# Altium schematic sheet Alim_Schematic.SchDoc: Alimentation et Regulation
size A4; Date: 13/04/2026; DrawnBy: JACOLOT Marine & GUILLEMOT Killian; Revision: Rev A; SheetNumber: 1; SheetTotal: 4
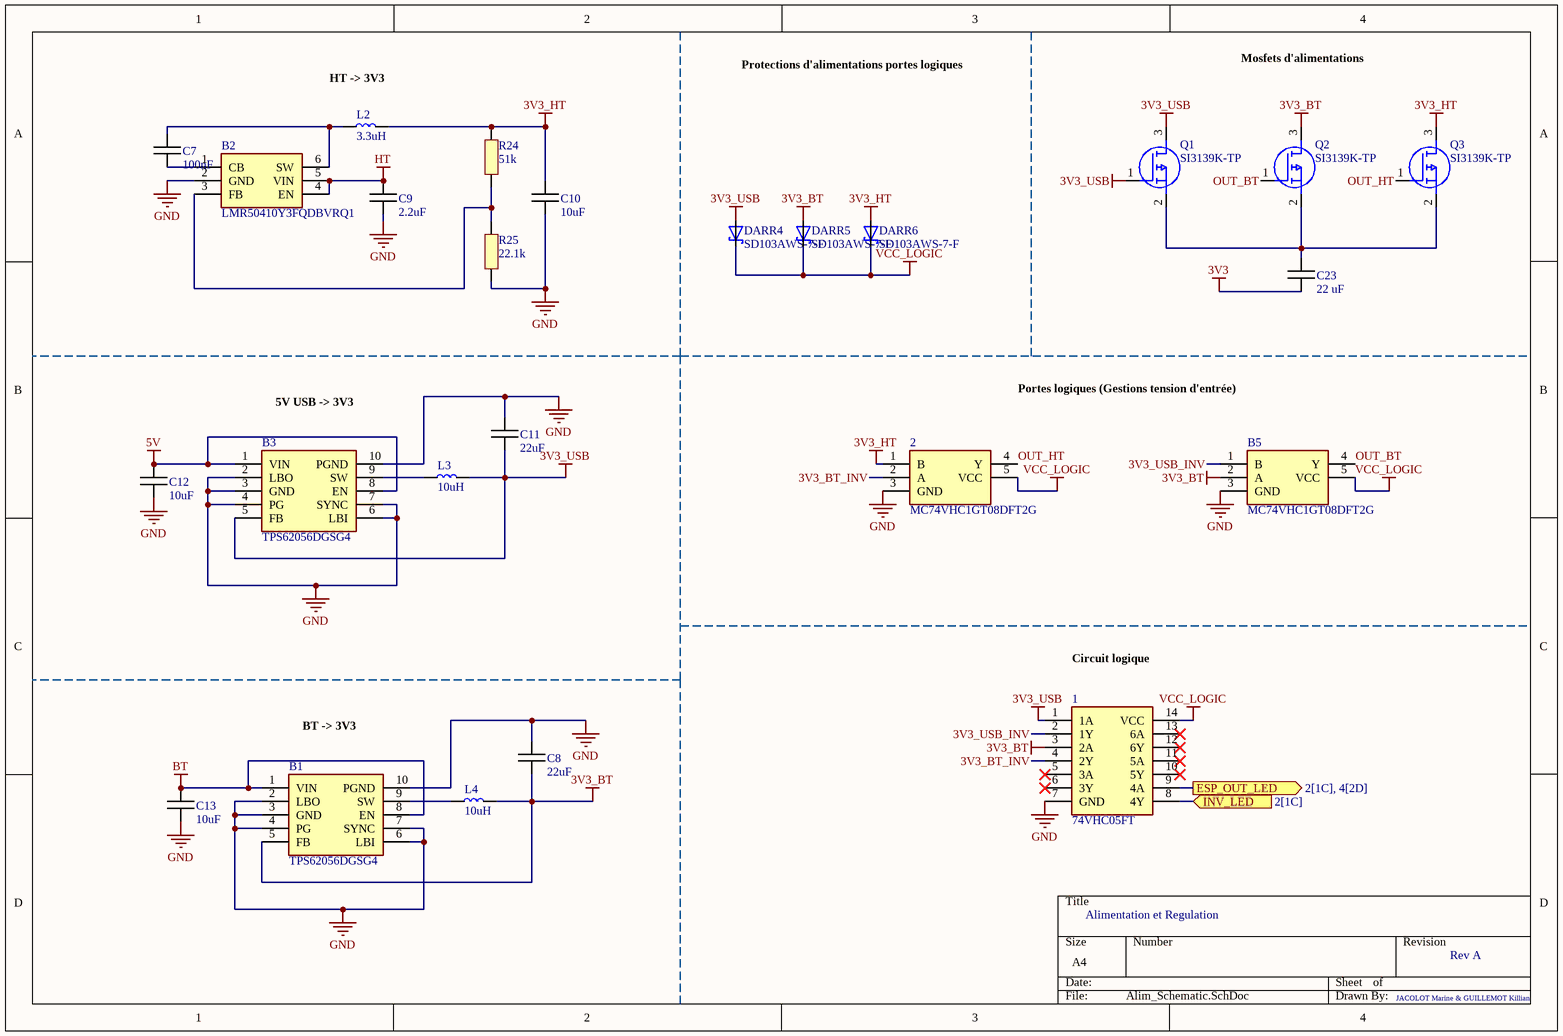
[diagram p0: Alim_Schematic.SchDoc]

## Parts
1  74VHC05FT  [SOP65P640X120-14N]
2  MC74VHC1GT08DFT2G  [SOT65P210X110-5N]
B1  TPS62056DGSG4  [SOP50P490X110-10N]
B2  LMR50410Y3FQDBVRQ1  [SOT95P280X145-6N]
B3  TPS62056DGSG4  [SOP50P490X110-10N]
B5  MC74VHC1GT08DFT2G  [SOT65P210X110-5N]
C7  100nF  [CAPC1005X06N]
C8  22uF  [CAPC1005X06N]
C9  2.2uF  [CAPC1005X06N]
C10  10uF  [CAPC1005X06N]
C11  22uF  [CAPC1005X06N]
C12  10uF  [CAPC1005X06N]
C13  10uF  [CAPC1005X06N]
C23  22 uF  [CAPC1005X06N]
DARR4  SD103AWS-7-F  [SD103AWS-7-F]
DARR5  SD103AWS-7-F  [SD103AWS-7-F]
DARR6  SD103AWS-7-F  [SD103AWS-7-F]
L2  3.3uH  [LQPC1005X06N]
L3  10uH  [LQPC1005X06N]
L4  10uH  [LQPC1005X06N]
Q1  SI3139K-TP  [SI3139K-TP]
Q2  SI3139K-TP  [SI3139K-TP]
Q3  SI3139K-TP  [SI3139K-TP]
R24  51k  [RESC1005X06N]
R25  22.1k  [RESC1005X06N]

## Ports
ESP_OUT_LED (out, see 2[1C], 4[2D]), INV_LED (in, see 2[1C])

## Nets
3V3: C23.1
3V3_BT: 1.3(2A) B1.5(FB) B5.2(A) C8.1 DARR5.2(A) L4.2 Q2.3(D)
3V3_HT: 2.1(B) C10.1 DARR6.2(A) L2.2 Q3.3(D) R24.1
3V3_USB: 1.1(1A) B3.5(FB) C11.1 DARR4.2(A) L3.2 Q1.1(G) Q1.3(D)
5V: B3.1(VIN) B3.8(EN) C12.1
BT: B1.1(VIN) B1.8(EN) C13.1
GND: 1.7(GND) 2.3(GND) B1.2(LBO) B1.3(GND) B1.4(PG) B1.6(LBI) B1.7(SYNC) B1.10(PGND) B2.2(GND) B3.2(LBO) B3.3(GND) B3.4(PG) B3.6(LBI) B3.7(SYNC) B3.10(PGND) B5.3(GND) C8.2 C9.2 C10.2 C11.2 C12.2 C13.2 R25.1
HT: B2.4(EN) B2.5(VIN) C9.1
VCC_LOGIC: 1.14(VCC) 2.5(VCC) B5.5(VCC) DARR4.1(C) DARR5.1(C) DARR6.1(C)
3V3_BT_INV: 1.4(2Y) 2.2(A)
3V3_USB_INV: 1.2(1Y) B5.1(B)
ESP_OUT_LED: 1.9(4A) ; port ESP_OUT_LED
INV_LED: 1.8(4Y) ; port INV_LED
OUT_BT: B5.4(Y) Q2.1(G)
OUT_HT: 2.4(Y) Q3.1(G)
NetB1_9: B1.9(SW) L4.1
NetB2_1: B2.1(CB) C7.2
NetB2_3: B2.3(FB) R24.2 R25.2
NetB2_6: B2.6(SW) C7.1 L2.1
NetB3_9: B3.9(SW) L3.1
NetC23_2: C23.2 Q1.2(S) Q2.2(S) Q3.2(S)

Not connected (* = marked no-connect by the designer): 1 5(3A)* 6(3Y)* 10(5Y)* 11(5A)* 12(6Y)* 13(6A)*

## Notes on the sheet
- (near L2) HT -> 3V3
- Protections d'alimentations portes logiques
- Mosfets d'alimentations
- 5V USB -> 3V3
- Portes logiques (Gestions tension d'entrée)
- Circuit logique
- BT -> 3V3

## Library data of the parts
1 = 74VHC05FT: Logic Gates CMOS LOGIC IC INVERTER; Manufacturer_Name: Toshiba; Manufacturer_Part_Number: 74VHC05FT; Mouser Part Number: 757-74VHC05FT
2 B5 = MC74VHC1GT08DFT2G: Single 2-Input AND Gate, TTL Level; Manufacturer_Name: onsemi; Manufacturer_Part_Number: MC74VHC1GT08DFT2G; Parameter 3: *
B1 B3 = TPS62056DGSG4: TEXAS INSTRUMENTS - TPS62056DGSG4 - Synchronous Buck (Step Down) Switching Regulator, Fixed, 2.7V-10Vin, 3.3V/0.8A out, 850kHz, VSSOP-10; Manufacturer_Name: Texas Instruments; Manufacturer_Part_Number: TPS62056DGSG4; Mouser Part Number: 595-TPS62056DGSG4
B2 = LMR50410Y3FQDBVRQ1: Régulateurs de tension de commutation Automotive qualified SIMPLE SWITCHER 4-V to 36-V, 1-A synchronous step-down converter 6-SOT-23 -40 to 150; Manufacturer_Name: Texas Instruments; Manufacturer_Part_Number: LMR50410Y3FQDBVRQ1; Mouser Part Number: 595-R50410Y3FQDBVRQ1
C7-C13 C23 = Capacitor
DARR4-DARR6 = SD103AWS-7-F: Diode Array 3 Independent Schottky 40V 175mA Surface Mount 6-TSSOP, SC-88, SOT-363
L2-L4 = Bobine
Q1-Q3 = SI3139K-TP: MOSFET P-Channel MOSFET
R24 R25 = Resistor